# EAGLE design arduino_ISCP (EAGLE 6.5.0)
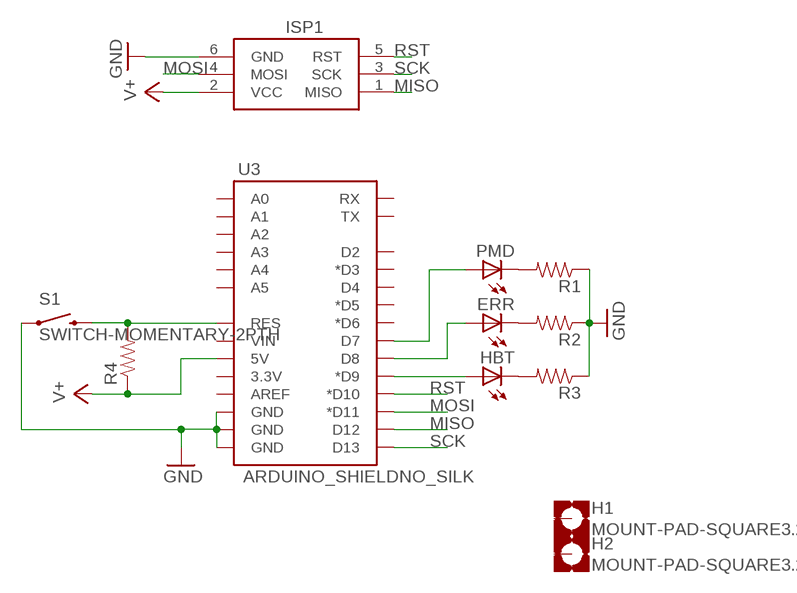
[diagram p0: schematic, sheet 1]

## Parts
ERR  LED5MM  [LED5MM]
H1  MOUNT-PAD-SQUARE3.2  [3,2-PAD-SQUARE]
H2  MOUNT-PAD-SQUARE3.2  [3,2-PAD-SQUARE]
HBT  LED5MM  [LED5MM]
ISP1  AVRISP-6  [AVRISP]
PMD  LED5MM  [LED5MM]
R1  RESISTORPTH-1/4W  [AXIAL-0.4]
R2  RESISTORPTH-1/4W  [AXIAL-0.4]
R3  RESISTORPTH-1/4W  [AXIAL-0.4]
R4  RESISTORPTH-1/4W  [AXIAL-0.4]
S1  SWITCH-MOMENTARY-2PTH  [TACTILE-PTH]
U3  ARDUINO_SHIELDNO_SILK  [DUEMILANOVE_VIAS]

## Nets
GND: ISP1.6(GND) R1.P$1 R2.P$1 R3.P$1 S1.1 U3.GND@0(GND) U3.GND@1(GND) U3.GND@2(GND)
MISO: ISP1.1(MISO) U3.D12
MOSI: ISP1.4(MOSI) U3.D11(*D11)
N$1: R4.P$2 S1.3 U3.RES
N$2: HBT.A U3.D9(*D9)
N$3: ERR.A U3.D8
N$4: PMD.A U3.D7
N$5: PMD.K(C) R1.P$2
N$6: ERR.K(C) R2.P$2
N$7: HBT.K(C) R3.P$2
RST: ISP1.5(RST) U3.D10(*D10)
SCK: ISP1.3(SCK) U3.D13
V+: ISP1.2(VCC) R4.P$1 U3.5V
Unconnected: H1.B3,2(MOUNT) H2.B3,2(MOUNT) U3.3.3V U3.A0 U3.A1 U3.A2 U3.A3 U3.A4 U3.A5 U3.AREF U3.D2 U3.D3(*D3) U3.D4 U3.D5(*D5) U3.D6(*D6) U3.RX U3.TX U3.VIN

## Library data of the parts
ERR HBT PMD = adafruit:LED: LED OSRAM: - CHIPLED LG R971, LG N971, LY N971, LG Q971, LY Q971, LO R971, LY R971 LH N974, LH R974 LS Q976, LO Q976, LY Q976 LO Q996 - Hyper CHIPLED LW Q18S LB Q993, LB Q99A, LB R99A - SideLED LS A670, LO A670, LY A670, LG A670, LP A670 LB A673, LV A673, LT A673, LW A673 LH A674 LY A675 LS A676, LA A676, LO A676, LY A676, LW A676 LS A679, LY A679, LG A679 - Hyper Micro SIDELED® LS Y876, LA Y876, LO Y876, LY Y876 LT Y87S - SmartLED LW L88C, LW L88S LB L89C, LB L89S, LG L890 LS L89K, LO L89K, LY L89K LS L896, LA L896, LO L896, LY L896 - TOPLED LS T670, LO T670, LY T670, LG T670, LP T670 LSG T670, LSP T670, LSY T670, LOP T670, LYG T670 LG T671, LOG T671, LSG T671 LB T673, LV T673, LT T673, LW T673 LH T674 LS T676, LA T676, LO T676, LY T676, LB T676, LH T676, LSB T676, LW T676 LB T67C, LV T67C, LT T67C, LS T67K, LO T67K, LY T67K, LW E67C LS E67B, LA E67B, LO E67B, LY E67B, LB E67C, LV E67C, LT E67C LW T67C LS T679, LY T679, LG T679 LS T770, LO T770, LY T770, LG T770, LP T770 LB T773, LV T773, LT T773, LW T773 LH T774 LS E675, LA E675, LY E675, LS T675 LS T776, LA T776, LO T776, LY T776, LB T776 LHGB T686 LT T68C, LB T68C - Hyper Mini TOPLED® LB M676 - Mini TOPLED Santana® LG M470 LS M47K, LO M47K, LY M47K Source: http://www.osram.convergy.de/
H1 H2 = holes:MOUNT-PAD-SQUARE: MOUNTING PAD, square
ISP1 = adafruit:AVRISP: AVR ISP HEADER Standard 6 pin header for AVR programming
R1-R4 = SparkFun-Passives:RESISTOR: Resistor Basic schematic elements and footprints for 0603, 1206, and PTH resistors.
S1 = SparkFun-Electromechanical:SWITCH-MOMENTARY-2: Various NO switches- pushbuttons, reed, etc
U3 = SparkFun-Boards:ARDUINO_SHIELD: Arduino shield footprint

## Board
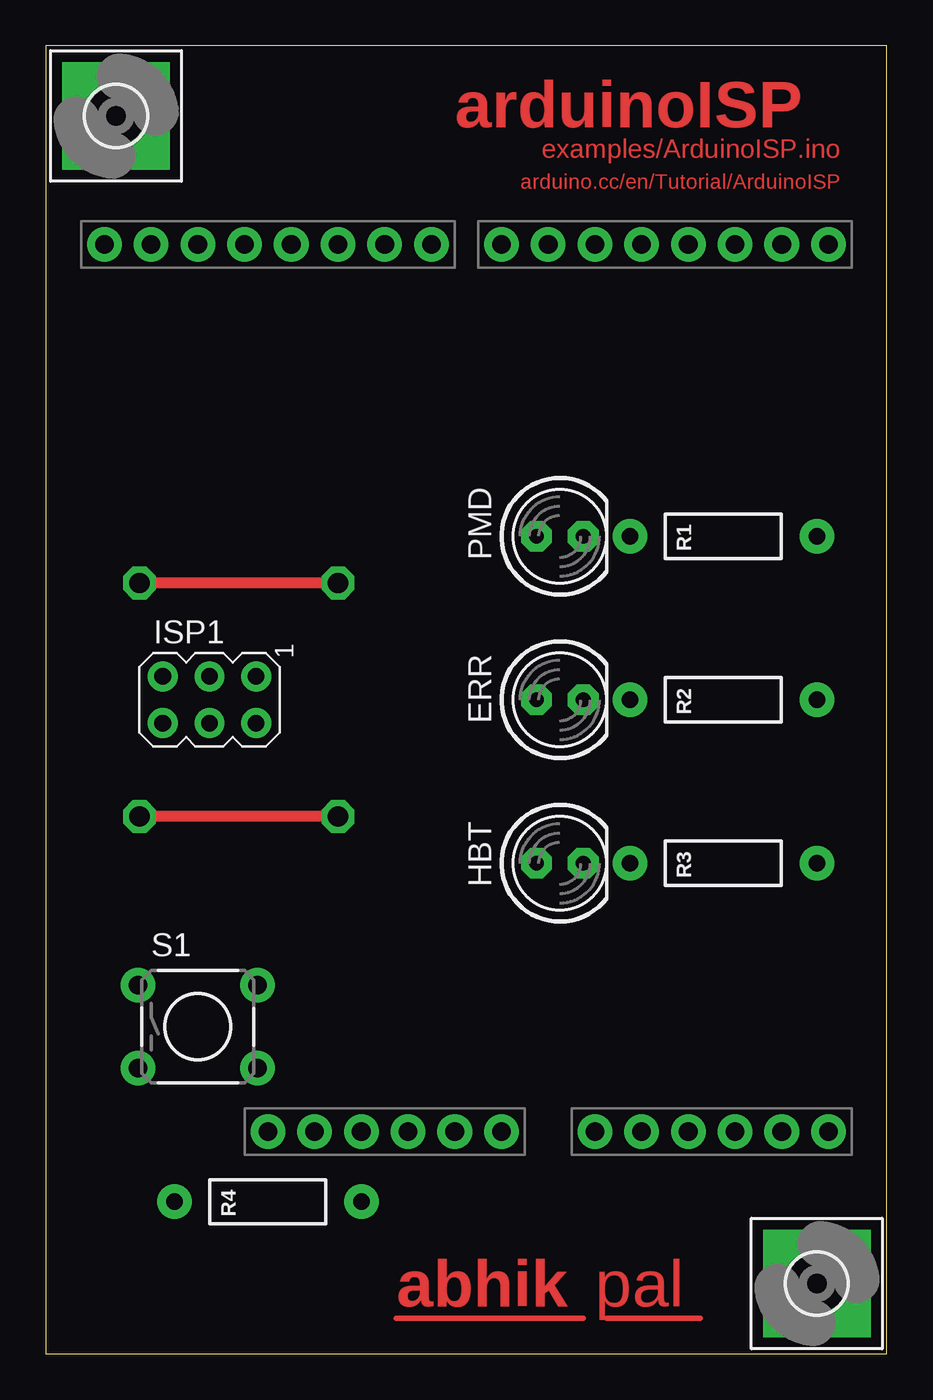
[diagram p1: board, top side]
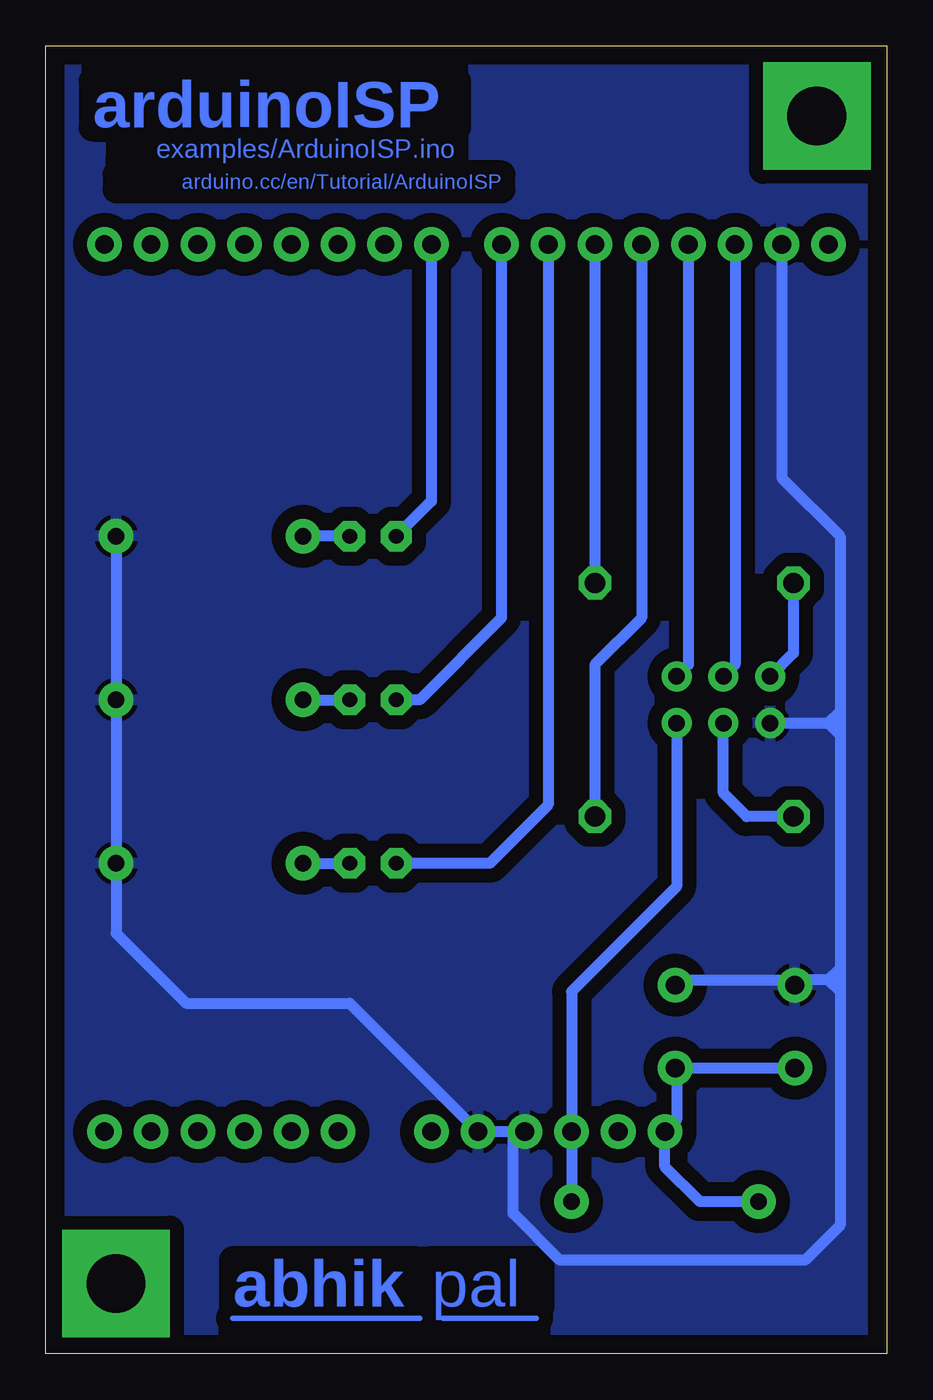
[diagram p2: board, bottom side, seen from below]

Size 45.72 x 71.12 mm. Coordinates in mm from the lower left corner, seen from the top.
Outline: 0,0 45.72,0 45.72,71.12 0,71.12 0,0
Copper layers (1*16): Top 0.035mm / dielectric 1.5mm / Bottom 0.035mm
Design rules "default *": minimum track width 24mil, minimum drill 24mil, track to track 30mil, track to pad 30mil, pad to pad 30mil, via to via 30mil, smd to smd 30mil, copper to edge 40mil, drill to drill 8mil, minimum pad ring 10mil, minimum via ring 8mil, stop-mask expansion 4mil, vias tented up to drill 0mil, thermal gap 10mil

### Footprints (pad centres in the part's own frame; a part is rotated, then mirrored left to right if it is on the bottom)
LED5MM = drill 0.813 pad 1.676 octagon: A -1.27,0; K 1.27,0
3,2-PAD-SQUARE = drill 3.2 pad 5.842 square: B3,2 0,0
AVRISP = drill 0.9 pad 1.626: 1 -1.27,2.54; 2 1.27,2.54; 3 -1.27,0; 4 1.27,0; 5 -1.27,-2.54; 6 1.27,-2.54
AXIAL-0.4 = drill 0.9 pad 1.88: P$1 -5.08,0; P$2 5.08,0
TACTILE-PTH = drill 1.016 pad 1.88: 1 -3.251,2.261; 2 3.251,2.261; 3 -3.251,-2.261; 4 3.251,-2.261
DUEMILANOVE_VIAS = drill 1.016 pad 1.88: 3.3V 50.8,13.97; 5V 50.8,16.51; A0 50.8,29.21; A1 50.8,31.75; A2 50.8,34.29; A3 50.8,36.83; A4 50.8,39.37; A5 50.8,41.91; AREF 2.54,2.54; D2 2.54,36.83; D3 2.54,34.29; D4 2.54,31.75; D5 2.54,29.21; D6 2.54,26.67; D7 2.54,24.13; D8 2.54,20.32; D9 2.54,17.78; D10 2.54,15.24; D11 2.54,12.7; D12 2.54,10.16; D13 2.54,7.62; GND@0 50.8,19.05; GND@1 50.8,21.59; GND@2 2.54,5.08; RES 50.8,11.43; RX 2.54,41.91; TX 2.54,39.37; VIN 50.8,24.13

### Placement (x,y rotation side)
ERR  27.94,35.56 0 top
H1  3.81,67.31 0 top
H2  41.91,3.81 0 top
HBT  27.94,26.67 0 top
ISP1  8.89,35.56 270 top
PMD  27.94,44.45 0 top
R1  36.83,44.45 180 top
R2  36.83,35.56 180 top
R3  36.83,26.67 180 top
R4  12.06,8.26 180 top
S1  8.26,17.78 0 top
U3  0.64,62.87 270 top

### Tracks (layer width: path | path; a pad name or v marks a point on that pad's centre or on a via)
GND
  Bottom 0.61: U3.GND@2 5.71,47.62 2.54,44.45 2.54,34.92 | 2.54,34.92 2.54,34.29 | R1.P$1 R2.P$1 R3.P$1 41.91,22.86 38.1,19.05 29.21,19.05 U3.GND@1 20.32,12.06 | U3.GND@0 20.32,12.06 | ISP1.6 3.17,34.29 | 3.17,34.29 2.54,34.29 | 2.54,34.29 2.54,33.66 | 2.54,33.66 2.54,20.95 | 2.54,20.95 2.54,19.68 | 2.54,19.68 2.54,6.99 4.45,5.08 17.78,5.08 20.32,7.62 20.32,12.06 | 3.17,34.29 2.54,34.92 | 3.17,34.29 2.54,33.66 | 3.17,20.32 2.54,20.95 | 3.17,20.32 2.54,19.68 | 3.17,20.32 5.28,20.32 | 11.43,20.32 5.28,20.32 | 5.28,20.32 S1.1
  pour Bottom: 0,71.12 45.72,71.12 45.72,0 0,0
MISO
  Bottom 0.61: U3.D12 10.79,37.47 ISP1.1
MOSI  (via drill 0.6, 0.6 pad 1.78, 1.1 pad 1.78)
  Top 0.61: v15.88,29.21 v5.08,29.21
  Bottom 0.61: U3.D11 13.34,40.01 15.88,37.47 v15.88,29.21 | v5.08,29.21 7.62,29.21 8.89,30.48 ISP1.4
N$1
  Bottom 0.61: S1.3 11.15,15.52 11.43,15.24 11.43,12.7 U3.RES 12.06,10.16 10.16,8.26 R4.P$2
N$2
  Bottom 0.61: U3.D9 18.41,29.84 21.59,26.67 HBT.A
N$3
  Bottom 0.61: U3.D8 20.95,40.01 25.4,35.56 ERR.A
N$4
  Bottom 0.61: U3.D7 24.77,46.35 PMD.A
N$5
  Bottom 0.61: PMD.K R1.P$2
N$6
  Bottom 0.61: R2.P$2 ERR.K
N$7
  Bottom 0.61: R3.P$2 HBT.K
N$8
  Top 0.305: 19.05,1.91 29.21,1.91
N$9
  Top 0.305: 30.48,1.91 35.56,1.91
N$10
  Bottom 0.305: 35.56,1.91 25.4,1.91
N$11
  Bottom 0.305: 24.13,1.91 19.05,1.91
RST  (via drill 0.6, 0.6 pad 1.78, 1.1 pad 1.78)
  Top 0.61: v15.88,41.91 v5.08,41.91
  Bottom 0.61: U3.D10 v15.88,41.91 | v5.08,41.91 5.08,38.1 ISP1.5
SCK
  Bottom 0.61: U3.D13 8.26,37.47 ISP1.3
V+
  Bottom 0.61: ISP1.2 11.43,25.4 17.14,19.68 U3.5V R4.P$1

### Text on the board
Top: arduinoISP | examples/ArduinoISP.ino | arduino.cc/en/Tutorial/ArduinoISP | abhik | pal
Bottom: arduinoISP | examples/ArduinoISP.ino | arduino.cc/en/Tutorial/ArduinoISP | pal | abhik